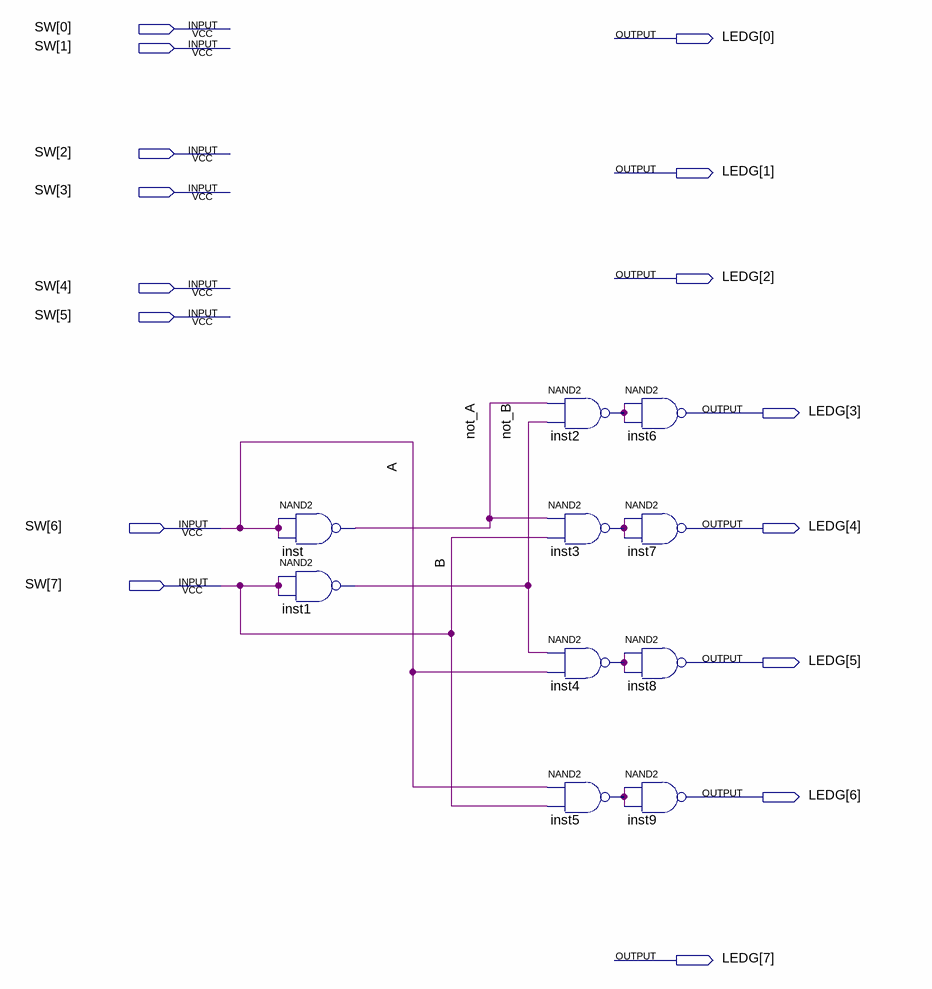
[diagram p0: schematic sheet]
// Quartus schematic LEDtest.bdf as structural Verilog: 10 symbols, 16 pins
module LEDtest (
  input  [7:0] SW,
  output [7:0] LEDG
);

  wire inst2_out, inst3_out, inst4_out, inst5_out, not_A, not_B;

  nand inst (not_A, SW[6], SW[6]);
  nand inst1 (not_B, SW[7], SW[7]);
  nand inst2 (inst2_out, not_A, not_B);
  nand inst3 (inst3_out, not_A, SW[7]);
  nand inst4 (inst4_out, not_B, SW[6]);
  nand inst5 (inst5_out, SW[6], SW[7]);
  nand inst6 (LEDG[3], inst2_out, inst2_out);
  nand inst7 (LEDG[4], inst3_out, inst3_out);
  nand inst8 (LEDG[5], inst4_out, inst4_out);
  nand inst9 (LEDG[6], inst5_out, inst5_out);

  // Other names for the same wires on the sheet: A = SW[6]; B = SW[7]
endmodule
